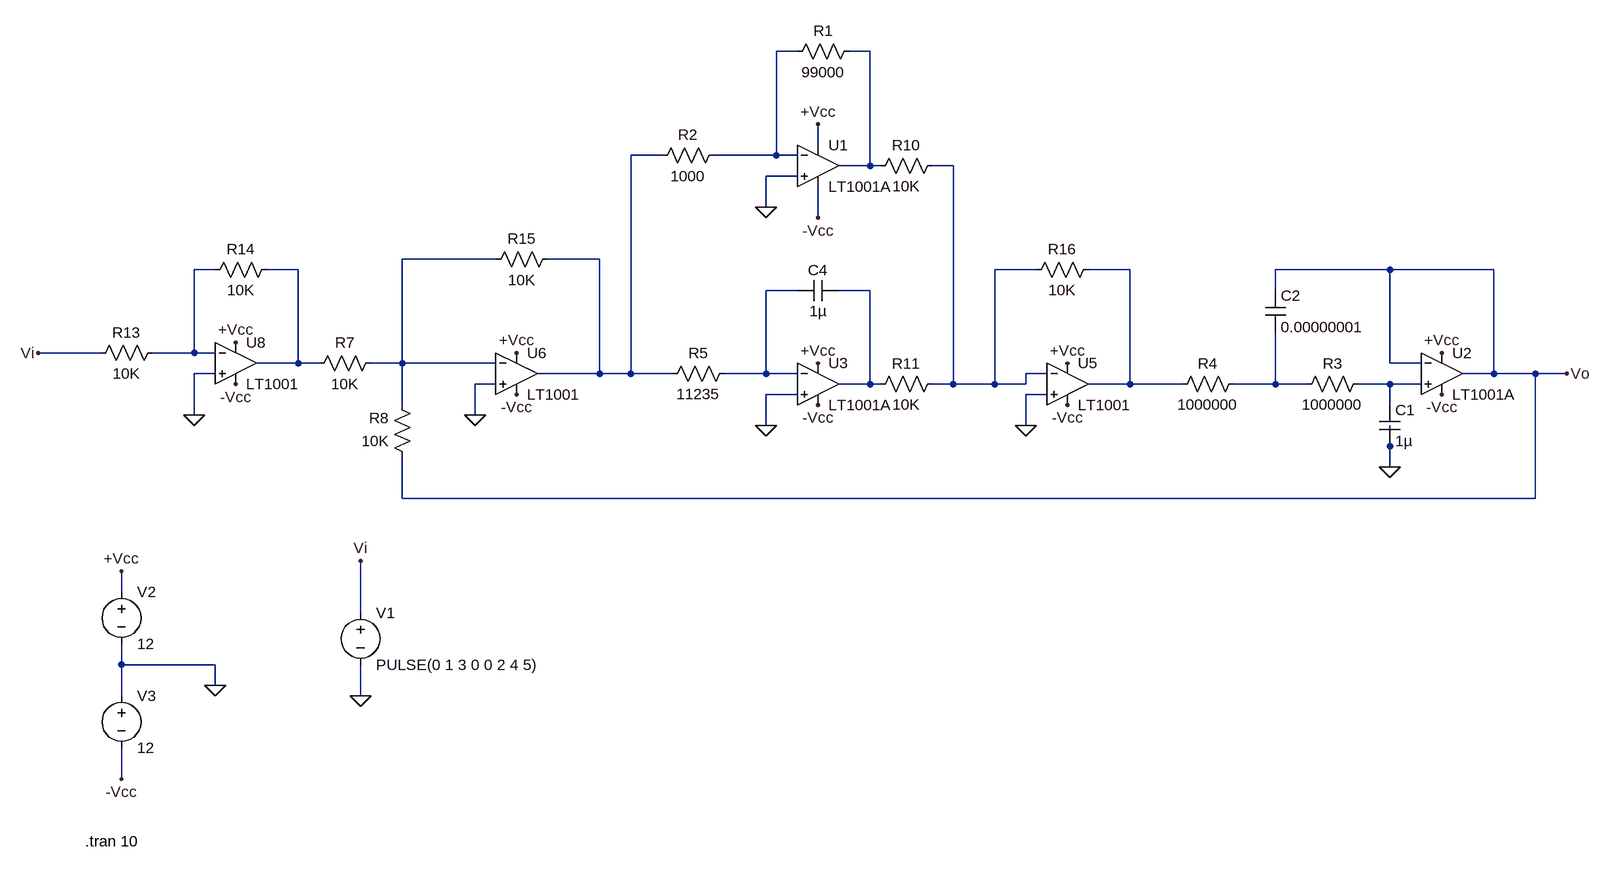
[diagram p0: schematic Circuitos_PI.asc]
Circuitos_PI.asc, the LTspice schematic file:
Version 4
SHEET 1 1532 1520
WIRE -672 -128 -704 -128
WIRE -560 -128 -592 -128
WIRE -640 16 -640 -16
WIRE -880 32 -928 32
WIRE -704 32 -704 -128
WIRE -704 32 -800 32
WIRE -672 32 -704 32
WIRE -560 48 -560 -128
WIRE -560 48 -608 48
WIRE -544 48 -560 48
WIRE -432 48 -464 48
WIRE -672 64 -720 64
WIRE -720 112 -720 64
WIRE -640 128 -640 80
WIRE -1136 192 -1280 192
WIRE -976 192 -1056 192
WIRE -1568 208 -1600 208
WIRE -1440 208 -1488 208
WIRE -304 208 -368 208
WIRE -160 208 -224 208
WIRE 240 208 64 208
WIRE 400 208 240 208
WIRE -672 240 -720 240
WIRE -560 240 -608 240
WIRE 64 240 64 208
WIRE -1744 336 -1840 336
WIRE -1600 336 -1600 208
WIRE -1600 336 -1664 336
WIRE -1568 336 -1600 336
WIRE -1440 352 -1440 208
WIRE -1440 352 -1504 352
WIRE -1408 352 -1440 352
WIRE -1280 352 -1280 192
WIRE -1280 352 -1328 352
WIRE -1136 352 -1280 352
WIRE 240 352 240 208
WIRE 288 352 240 352
WIRE -1568 368 -1600 368
WIRE -976 368 -976 192
WIRE -976 368 -1072 368
WIRE -928 368 -928 32
WIRE -928 368 -976 368
WIRE -864 368 -928 368
WIRE -720 368 -720 240
WIRE -720 368 -784 368
WIRE -672 368 -720 368
WIRE -288 368 -320 368
WIRE 400 368 400 208
WIRE 400 368 352 368
WIRE 464 368 400 368
WIRE 512 368 464 368
WIRE -1136 384 -1168 384
WIRE -560 384 -560 240
WIRE -560 384 -608 384
WIRE -544 384 -560 384
WIRE -432 384 -432 48
WIRE -432 384 -464 384
WIRE -368 384 -368 208
WIRE -368 384 -432 384
WIRE -320 384 -320 368
WIRE -320 384 -368 384
WIRE -160 384 -160 208
WIRE -160 384 -224 384
WIRE -80 384 -160 384
WIRE 64 384 64 304
WIRE 64 384 0 384
WIRE 112 384 64 384
WIRE 240 384 192 384
WIRE 288 384 240 384
WIRE -672 400 -720 400
WIRE -288 400 -320 400
WIRE -1280 416 -1280 352
WIRE 240 416 240 384
WIRE -1600 432 -1600 368
WIRE -1168 432 -1168 384
WIRE -720 448 -720 400
WIRE -320 448 -320 400
WIRE 240 480 240 448
WIRE 240 512 240 480
WIRE -1280 560 -1280 496
WIRE 464 560 464 368
WIRE 464 560 -1280 560
WIRE -1712 704 -1712 672
WIRE -1344 736 -1344 656
WIRE -1712 816 -1712 784
WIRE -1568 816 -1712 816
WIRE -1568 848 -1568 816
WIRE -1712 864 -1712 816
WIRE -1344 864 -1344 816
WIRE -1712 992 -1712 944
FLAG -720 112 0
FLAG -1344 864 0
FLAG -1568 848 0
FLAG -1712 672 +Vcc
FLAG -1712 992 -Vcc
FLAG -640 -16 +Vcc
FLAG -640 128 -Vcc
FLAG 320 336 +Vcc
FLAG 320 400 -Vcc
FLAG -720 448 0
FLAG -640 352 +Vcc
FLAG -640 416 -Vcc
FLAG -320 448 0
FLAG -256 352 +Vcc
FLAG -256 416 -Vcc
FLAG -1104 336 +Vcc
FLAG -1104 400 -Vcc
FLAG -1168 432 0
FLAG -1600 432 0
FLAG -1840 336 Vi
FLAG 512 368 Vo
FLAG -1344 656 Vi
FLAG -1536 320 +Vcc
FLAG -1536 384 -Vcc
FLAG 240 512 0
SYMBOL OpAmps\\LT1001A -640 -16 R0
SYMATTR InstName U1
SYMBOL res -576 -144 R90
WINDOW 0 0 56 VBottom 2
WINDOW 3 32 56 VTop 2
SYMATTR InstName R1
SYMATTR Value 99000
SYMBOL res -784 16 R90
WINDOW 0 0 56 VBottom 2
WINDOW 3 32 56 VTop 2
SYMATTR InstName R2
SYMATTR Value 1000
SYMBOL voltage -1344 720 R0
WINDOW 123 0 0 Left 0
WINDOW 39 0 0 Left 0
SYMATTR InstName V1
SYMATTR Value PULSE(0 1 3 0 0 2 4 5)
SYMBOL voltage -1712 688 R0
WINDOW 123 0 0 Left 0
WINDOW 39 0 0 Left 0
SYMATTR InstName V2
SYMATTR Value 12
SYMBOL voltage -1712 848 R0
WINDOW 123 0 0 Left 0
WINDOW 39 0 0 Left 0
SYMATTR InstName V3
SYMATTR Value 12
SYMBOL OpAmps\\LT1001A 320 304 R0
SYMATTR InstName U2
SYMBOL res 208 368 R90
WINDOW 0 0 56 VBottom 2
WINDOW 3 32 56 VTop 2
SYMATTR InstName R3
SYMATTR Value 1000000
SYMBOL res 16 368 R90
WINDOW 0 0 56 VBottom 2
WINDOW 3 32 56 VTop 2
SYMATTR InstName R4
SYMATTR Value 1000000
SYMBOL cap 224 416 R0
SYMATTR InstName C1
SYMATTR Value 1µ
SYMBOL cap 48 240 R0
SYMATTR InstName C2
SYMATTR Value 0.00000001
SYMBOL OpAmps\\LT1001A -640 320 R0
SYMATTR InstName U3
SYMBOL res -768 352 R90
WINDOW 0 0 56 VBottom 2
WINDOW 3 32 56 VTop 2
SYMATTR InstName R5
SYMATTR Value 11235
SYMBOL cap -608 224 R90
WINDOW 0 0 32 VBottom 2
WINDOW 3 32 32 VTop 2
SYMATTR InstName C4
SYMATTR Value 1µ
SYMBOL OpAmps\\LT1001 -256 320 R0
SYMATTR InstName U5
SYMBOL OpAmps\\LT1001 -1104 304 R0
SYMATTR InstName U6
SYMBOL res -1312 336 R90
WINDOW 0 0 56 VBottom 2
WINDOW 3 32 56 VTop 2
SYMATTR InstName R7
SYMATTR Value 10K
SYMBOL res -1264 512 R180
WINDOW 0 36 76 Left 2
WINDOW 3 36 40 Left 2
SYMATTR InstName R8
SYMATTR Value 10K
SYMBOL res -448 32 R90
WINDOW 0 0 56 VBottom 2
WINDOW 3 32 56 VTop 2
SYMATTR InstName R10
SYMATTR Value 10K
SYMBOL res -448 368 R90
WINDOW 0 0 56 VBottom 2
WINDOW 3 32 56 VTop 2
SYMATTR InstName R11
SYMATTR Value 10K
SYMBOL OpAmps\\LT1001 -1536 288 R0
SYMATTR InstName U8
SYMBOL res -1648 320 R90
WINDOW 0 0 56 VBottom 2
WINDOW 3 32 56 VTop 2
SYMATTR InstName R13
SYMATTR Value 10K
SYMBOL res -1472 192 R90
WINDOW 0 0 56 VBottom 2
WINDOW 3 32 56 VTop 2
SYMATTR InstName R14
SYMATTR Value 10K
SYMBOL res -1040 176 R90
WINDOW 0 0 56 VBottom 2
WINDOW 3 32 56 VTop 2
SYMATTR InstName R15
SYMATTR Value 10K
SYMBOL res -208 192 R90
WINDOW 0 0 56 VBottom 2
WINDOW 3 32 56 VTop 2
SYMATTR InstName R16
SYMATTR Value 10K
TEXT -1768 1088 Left 2 !.tran 10

The netlist it stands for:
* Circuitos_PI.asc
XU1 0 N001 +Vcc -Vcc N002 LT1001  ; LT1001A, pins In+ In- V+ V- OUT
R1 N002 N001 99000
R2 N001 N003 1000
V1 Vi 0 PULSE(0 1 3 0 0 2 4 5)
V2 +Vcc 0 12
V3 0 -Vcc 12
XU2 N012 Vo +Vcc -Vcc Vo LT1001  ; LT1001A, pins In+ In- V+ V- OUT
R3 N012 N011 1000000
R4 N011 N008 1000000
C1 N012 0 1µ
C2 Vo N011 0.00000001
XU3 0 N009 +Vcc -Vcc N010 LT1001  ; LT1001A, pins In+ In- V+ V- OUT
R5 N009 N003 11235
C4 N010 N009 1µ
XU5 0 N004 +Vcc -Vcc N008 LT1001  ; pins In+ In- V+ V- OUT
XU6 0 N005 +Vcc -Vcc N003 LT1001  ; pins In+ In- V+ V- OUT
R7 N005 N007 10K
R8 Vo N005 10K
R10 N004 N002 10K
R11 N004 N010 10K
XU8 0 N006 +Vcc -Vcc N007 LT1001  ; pins In+ In- V+ V- OUT
R13 N006 Vi 10K
R14 N007 N006 10K
R15 N003 N005 10K
R16 N008 N004 10K
.tran 10
.lib LTC.lib
.backanno
.end